# Altium schematic sheet Thermocouples.SchDoc
size Letter; Organization: Altium Limited; Address1: L3, 12a Rodborough Rd; Address2: Frenchs Forest; Address3: NSW; Address4: Australia 2086
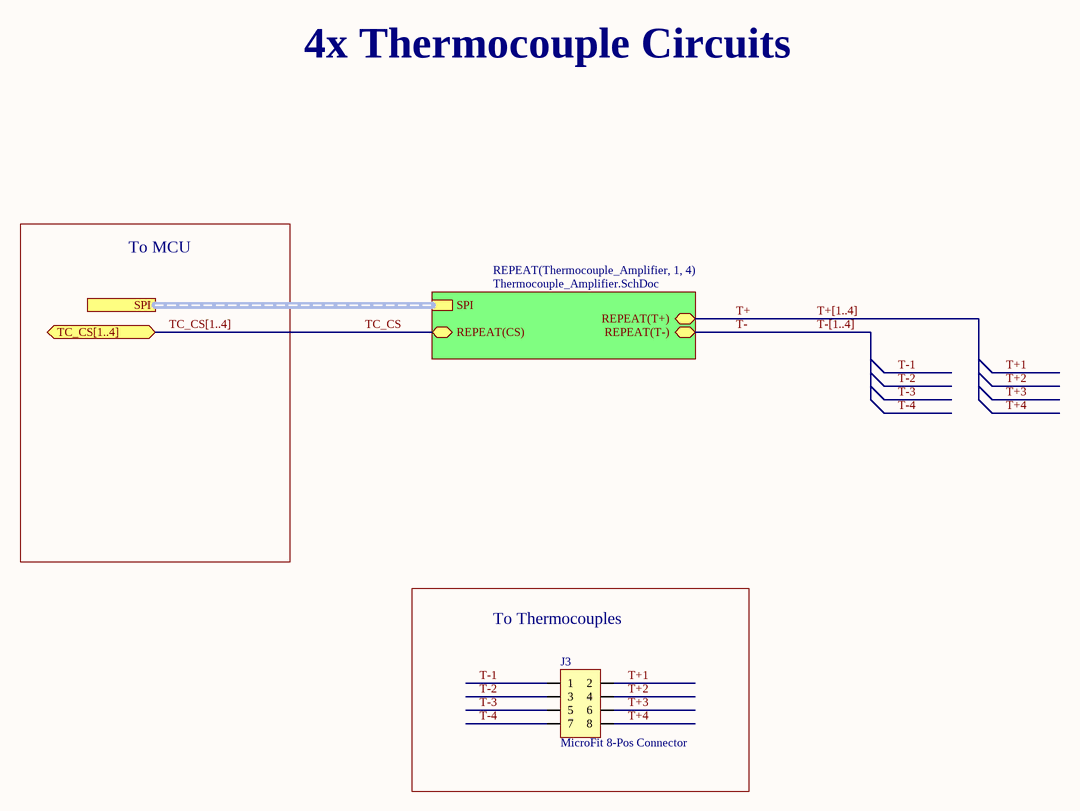
[diagram p0: Thermocouples.SchDoc]

## Parts
J3  MicroFit 8-Pos Connector  [Microfit-8Pos]

## Blocks framed on the sheet
To Thermocouples: J3

## Sub-sheets
REPEAT(Thermocouple_Amplifier, 1, 4) = Thermocouple_Amplifier.SchDoc: SPI (harness SPI), REPEAT(CS) (bidir), REPEAT(T+) (bidir), REPEAT(T-) (bidir)

## Ports
SPI (harness SPI), TC_CS[1..4] (bidir)

## Nets
T+: sheet REPEAT(Thermocouple_Amplifier, 1, 4)/REPEAT(T+)
T+1: J3.2
T+2: J3.4
T+3: J3.6
T+4: J3.8
T-: sheet REPEAT(Thermocouple_Amplifier, 1, 4)/REPEAT(T-)
T-1: J3.1
T-2: J3.3
T-3: J3.5
T-4: J3.7
TC_CS: sheet REPEAT(Thermocouple_Amplifier, 1, 4)/REPEAT(CS)

## Buses and harness runs
bus T+[1..4]
bus T-[1..4]
bus TC_CS[1..4] = port TC_CS[1..4]
harness port SPI = sheet REPEAT(Thermocouple_Amplifier, 1, 4)/SPI

## Notes on the sheet
- 4x Thermocouple Circuits
- To MCU
- Title
- Size:
- Date:
- Letter
- Number:
- Time:
- Revision:
- Sheet
- of
- File:

## Library data of the parts
J3 = Micro-Fit 8Pos: Molex MicroFit 8-Pos Connector; URL: https://www.digikey.com/products/en?WT.z_cid=sp_900_0310_buynow&keywords=430450813; DigiKey PN: WM2651-ND